# Altium schematic sheet w31_20172_1st_Schematic.SchDoc
size A4
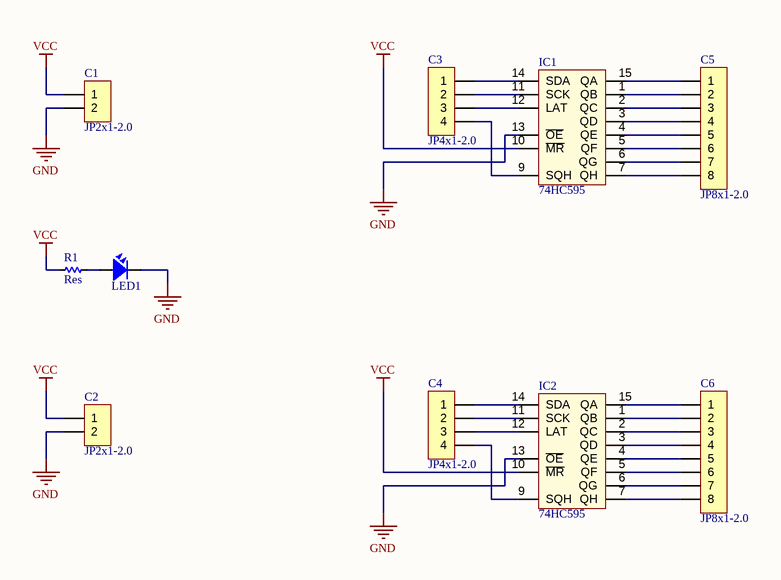
[diagram p0: w31_20172_1st_Schematic.SchDoc]

## Parts
C1  JP2x1-2.0  [J2-C1T]
C2  JP2x1-2.0  [J2-C1T]
C3  JP4x1-2.0  [J4-C1T]
C4  JP4x1-2.0  [J4-C1T]
C5  JP8x1-2.0  [J8-C1T]
C6  JP8x1-2.0  [J8-C1T]
IC1  74HC595  [DIP16]
IC2  74HC595  [DIP16]
LED1  LED  [LED-0805-Blue]  (value not drawn)
R1  Res  [RES-SMD-0805]

## Nets
GND: C1.2 C2.2 IC1.8(GND) IC1.13(~{OE}) IC2.8(GND) IC2.13(~{OE}) LED1.2
VCC: C1.1 C2.1 IC1.10(~{MR}) IC1.16(VCC) IC2.10(~{MR}) IC2.16(VCC) R1.2
NetC3_1: C3.1 IC1.14(SDA)
NetC3_2: C3.2 IC1.11(SCK)
NetC3_3: C3.3 IC1.12(LAT)
NetC3_4: C3.4 IC1.9(SQH)
NetC4_1: C4.1 IC2.14(SDA)
NetC4_2: C4.2 IC2.11(SCK)
NetC4_3: C4.3 IC2.12(LAT)
NetC4_4: C4.4 IC2.9(SQH)
NetC5_1: C5.1 IC1.15(QA)
NetC5_2: C5.2 IC1.1(QB)
NetC5_3: C5.3 IC1.2(QC)
NetC5_4: C5.4 IC1.3(QD)
NetC5_5: C5.5 IC1.4(QE)
NetC5_6: C5.6 IC1.5(QF)
NetC5_7: C5.7 IC1.6(QG)
NetC5_8: C5.8 IC1.7(QH)
NetC6_1: C6.1 IC2.15(QA)
NetC6_2: C6.2 IC2.1(QB)
NetC6_3: C6.3 IC2.2(QC)
NetC6_4: C6.4 IC2.3(QD)
NetC6_5: C6.5 IC2.4(QE)
NetC6_6: C6.6 IC2.5(QF)
NetC6_7: C6.7 IC2.6(QG)
NetC6_8: C6.8 IC2.7(QH)
NetLED1_1: LED1.1 R1.1

## Library data of the parts
C1 C2 = JP2x1-2.0: WR-PHD 2.00 mm Socket Header; Manufacturer: W¨¹rth Elektronik eiSos GmbH; partNo: 62000211821; ComponentLink1 Description: Manufacturer; ComponentLink2 Description: Datasheet; NoPins: 02; Created Date: 2 April 2013; ComponentLink1URL: http://www.we-online.com; ComponentLink2URL: http://katalog.we-online.de/em/datasheet/6200xx11821.pdf; Created by: Karrer Zheng
C3 C4 = JP4x1-2.0: WR-PHD 2.00 mm Socket Header; Manufacturer: W¨¹rth Elektronik eiSos GmbH; partNo: 62000411821; ComponentLink1 Description: Manufacturer; ComponentLink2 Description: Datasheet; NoPins: 04; Created Date: 2 April 2013; ComponentLink1URL: http://www.we-online.com; ComponentLink2URL: http://katalog.we-online.de/em/datasheet/6200xx11821.pdf; Created by: Karrer Zheng
C5 C6 = JP8x1-2.0: WR-PHD 2.00 mm Socket Header; Manufacturer: W¨¹rth Elektronik eiSos GmbH; partNo: 62000811821; ComponentLink1 Description: Manufacturer; ComponentLink2 Description: Datasheet; NoPins: 08; Created Date: 2 April 2013; ComponentLink1URL: http://www.we-online.com; ComponentLink2URL: http://katalog.we-online.de/em/datasheet/6200xx11821.pdf; Created by: Karrer Zheng
IC1 IC2 = 74595: 8 Bit Serial input - Parallel Output; Value: 74HC595
LED1 = LED SMD: Value: LED 3 - 5 ly 2 Colour
R1 = Res-SMD: Resistor; Manufacturer: Generic Components; Class: Passive; Published: 08/06/2000; Publisher: Altium Hobart Technology Centre